# EAGLE schematic SwitchUp (EAGLE 9.1.3)
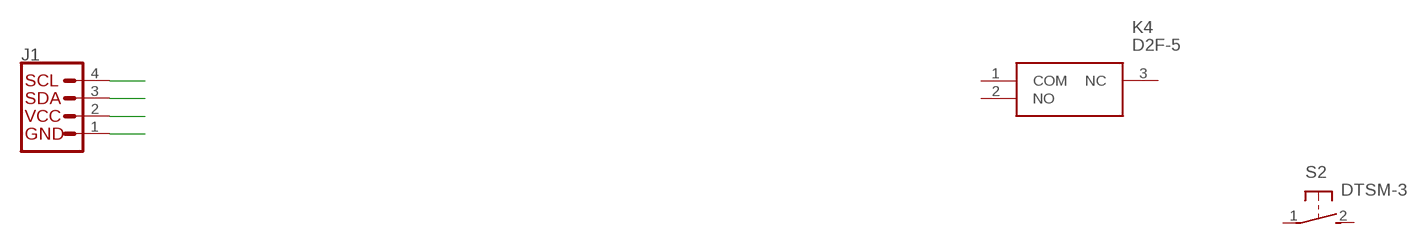
[diagram p0: schematic, sheet 1]

## Parts
J1  QWIIC_CONNECTORJS-1MM  [1X04_1MM_RA]
K4  D2F-5  [SHDR3W100P0X508_1X3_1280X580X5]
S2  DTSM-3  [DTSM-3]

## Nets
N$10: J1.4(SCL)
N$11: J1.3(SDA)
N$12: J1.2(VCC)
N$13: J1.1(GND)
Unconnected: K4.1(COM) K4.2(NO) K4.3(NC) S2.1 S2.2

## Library data of the parts
J1 = SparkFun-Connectors:QWIIC_CONNECTOR: SparkFun I2C Standard Qwiic Connector An SMD 1mm pitch JST connector makes it easy and quick (get it? Qwiic?) to connect I2C devices to each other. The Qwiic system <http://www.sparkfun.com/qwiic> enables fast and solderless connection between popular platforms and various sensors and actuators. We carry 200mm <https://www.sparkfun.com/products/14204>, 100mm <https://www.sparkfun.com/products/14205>, 50mm <https://www.sparkfun.com/products/14206>, and breadboard friendly <https://www.sparkfun.com/products/14207> Qwiic cables. We also offer 10 pcs strips <https://www.sparkfun.com/products/14323> the SMD connectors.
K4 = D2F-5:D2F-5: OMRON ELECTRONIC COMPONENTS - D2F-5 - MICROSWITCH, PLUNGER, SPDT, 5A, 250V, TH Source: Datasheet <http://omronfs.omron.com/en_US/ecb/products/pdf/en-d2f.pdf>; ALLIED_NUMBER: 71203873; ALLIED_PRICE-STOCK: https://www.alliedelec.com/omron-electronic-components-d2f-5/71203873/; DESCRIPTION: OMRON ELECTRONIC COMPONENTS - D2F-5 - MICROSWITCH, PLUNGER, SPDT, 5A, 250V, TH; HEIGHT: 5.8mm; MANUFACTURER_NAME: Omron Electronics; MANUFACTURER_PART_NUMBER: D2F-5; MOUSER_PART_NUMBER: 653-D2F-5; MOUSER_PRICE-STOCK: https://www.mouser.com/Search/Refine.aspx?Keyword=653-D2F-5
S2 = switch-tact:DTSM-3